# EAGLE design backscatter_frontend (EAGLE 9.6.2)
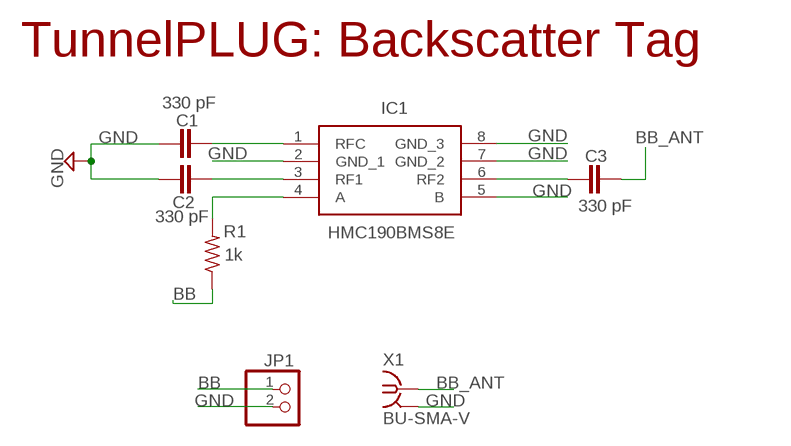
[diagram p0: schematic, sheet 1]

## Parts
C1  330 pF  C-EUC0603K  [C0603K]
C2  330 pF  C-EUC0603K  [C0603K]
C3  330 pF  C-EUC0603K  [C0603K]
IC1  HMC190BMS8E  [SOP65P488X110-8N]
JP1  PINHD-1X2/L90  [1X02/90]
R1  1k  R-US_M0805  [M0805]
X1  BU-SMA-V  [BU-SMA-V]

## Nets
BB: JP1.1 R1.1
BB_ANT: C3.2 X1.1
GND: C1.1 C2.1 IC1.2(GND_1) IC1.5(B) IC1.7(GND_2) IC1.8(GND_3) JP1.2 X1.2 X1.3 X1.4 X1.5
N$1: C1.2 IC1.1(RFC)
N$3: C2.2 IC1.3(RF1)
N$4: IC1.4(A) R1.2
N$6: C3.1 IC1.6(RF2)

## Notes on the sheet
- TunnelPLUG: Backscatter Tag

## Library data of the parts
C1-C3 = rcl:C-EU: CAPACITOR, European symbol; SPICEPREFIX: C
IC1 = HMC190BMS8E:HMC190BMS8E: RF Switch SPDT 0MHz to 3GHz 19dB 8-Pin MSOP Cut Tape Source: Datasheet <https://www.arrow.com/en/products/hmc190bms8e/analog-devices>; DESCRIPTION: RF Switch SPDT 0MHz to 3GHz 19dB 8-Pin MSOP Cut Tape; HEIGHT: 1.1mm; MANUFACTURER_NAME: Analog Devices; MANUFACTURER_PART_NUMBER: HMC190BMS8E; MOUSER_PART_NUMBER: 584-HMC190BMS8E; MOUSER_PRICE-STOCK: https://www.mouser.co.uk/ProductDetail/Analog-Devices/HMC190BMS8E?qs=664zcAxDQ0nfgyX38XAa6g%3D%3D
JP1 = pin_header:PINHD-1X2: PIN HEADER
R1 = rcl:R-US_: RESISTOR, American symbol; SPICEPREFIX: R
X1 = con-coax:BU-SMA-V: FEMALE SMA CONNECTOR Radiall distributor RS 112-3794; OC_FARNELL: unknown; OC_NEWARK: unknown

## Board
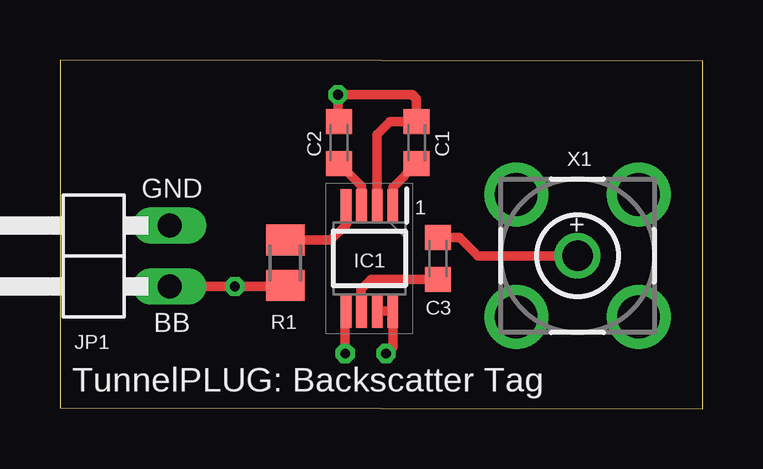
[diagram p1: board, top side]
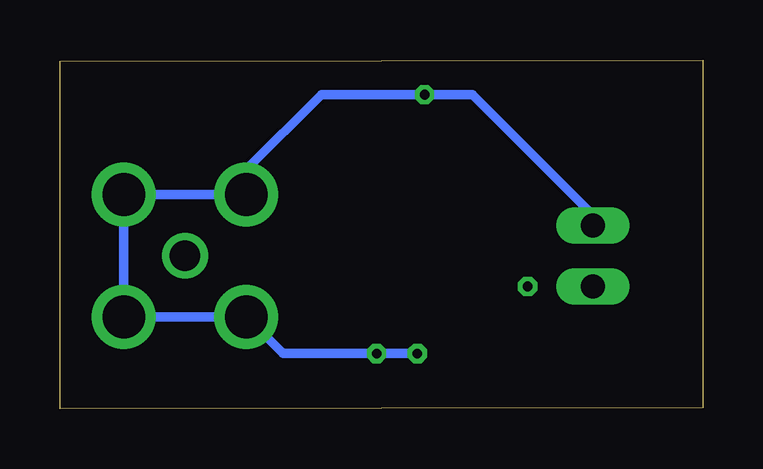
[diagram p2: board, bottom side, seen from below]

Size 26.79 x 14.55 mm. Coordinates in mm from the lower left corner, seen from the top.
Outline: 0,0.05 26.79,0 26.79,14.5 0,14.55 0,0.05
Copper layers (1*16): Top 0.035mm / dielectric 1.5mm / Bottom 0.035mm
Design rules "default": minimum track width 6mil, minimum drill 0.35mm, track to track 6mil, track to pad 6mil, pad to pad 6mil, via to via 6mil, smd to smd 6mil, copper to edge 40mil, drill to drill 6mil, minimum pad ring 10mil, minimum via ring 8mil, stop-mask expansion 4mil, vias tented up to drill 0mil, thermal gap 10mil

### Footprints (pad centres in the part's own frame; a part is rotated, then mirrored left to right if it is on the bottom)
C0603K = smd 1.05 x 1.08: 1 -0.875,0; 2 0.875,0
SOP65P488X110-8N = smd 1.4 x 0.45: 1 -2.2,0.975; 2 -2.2,0.325; 3 -2.2,-0.325; 4 -2.2,-0.975; 5 2.2,-0.975; 6 2.2,-0.325; 7 2.2,0.325; 8 2.2,0.975
1X02/90 = drill 1.016 long: 1 -1.27,-3.81; 2 1.27,-3.81
M0805 = smd 1.3 x 1.6: 1 -0.95,0; 2 0.95,0
BU-SMA-V = drill 1.27: 1 0,0 | drill 1.778: 2 -2.55,2.55; 3 2.55,2.55; 4 2.55,-2.55; 5 -2.55,-2.55

### Placement (x,y rotation side)
C1  14.87,11.1 270 top
C2  11.63,11.1 270 top
C3  15.77,6.27 90 top
IC1  12.9,6.27 270 top
JP1  0.76,6.37 90 top
R1  9.39,6.08 90 top
X1  21.58,6.38 0 top

### Tracks (layer width: path | path; a pad name or v marks a point on that pad's centre or on a via)
BB  (via drill 0.4)
  Top 0.2: 9.36,5.1 R1.1
  Top 0.4: JP1.1 v7.29,5.1 9.36,5.1
BB_ANT
  Top 0.4: X1.1 17.43,6.38 16.67,7.14 C3.2
GND  (via drill 0.4)
  Top 0.2: C2.1 11.59,12.01 | 11.89,4.04 IC1.5
  Top 0.4: 11.59,12.01 v11.59,13.1 14.69,13.1 14.87,12.92 C1.1 13.76,11.97 13.23,11.43 IC1.2 13.25,8.5 | v11.89,2.3 11.89,4.04 | IC1.7 IC1.8 13.88,2.58 v13.59,2.3
  Bottom 0.4: v11.89,2.3 v13.59,2.3 17.5,2.3 X1.5 X1.4 X1.3 X1.2 19.03,9.97 15.89,13.1 v11.59,13.1 9.59,13.1 4.57,8.08 JP1.2
N$1
  Top 0.4: IC1.1 13.88,9.23 C1.2
N$3
  Top 0.4: IC1.3 12.58,9.28 C2.2
N$4
  Top 0.4: 11.93,7.67 11.29,7.03 R1.2
  Top 0.406: IC1.4 11.93,7.67
N$6
  Top 0.2: IC1.6 12.55,4.1
  Top 0.4: 12.55,4.1 12.55,4.98 12.97,5.39 C3.1

### Text on the board
tNames: GND | 1 | + | BB | TunnelPLUG: Backscatter Tag